# Altium schematic sheet GRITS Pi Hat.SchDoc
size C; SheetNumber: 1; SheetTotal: 1
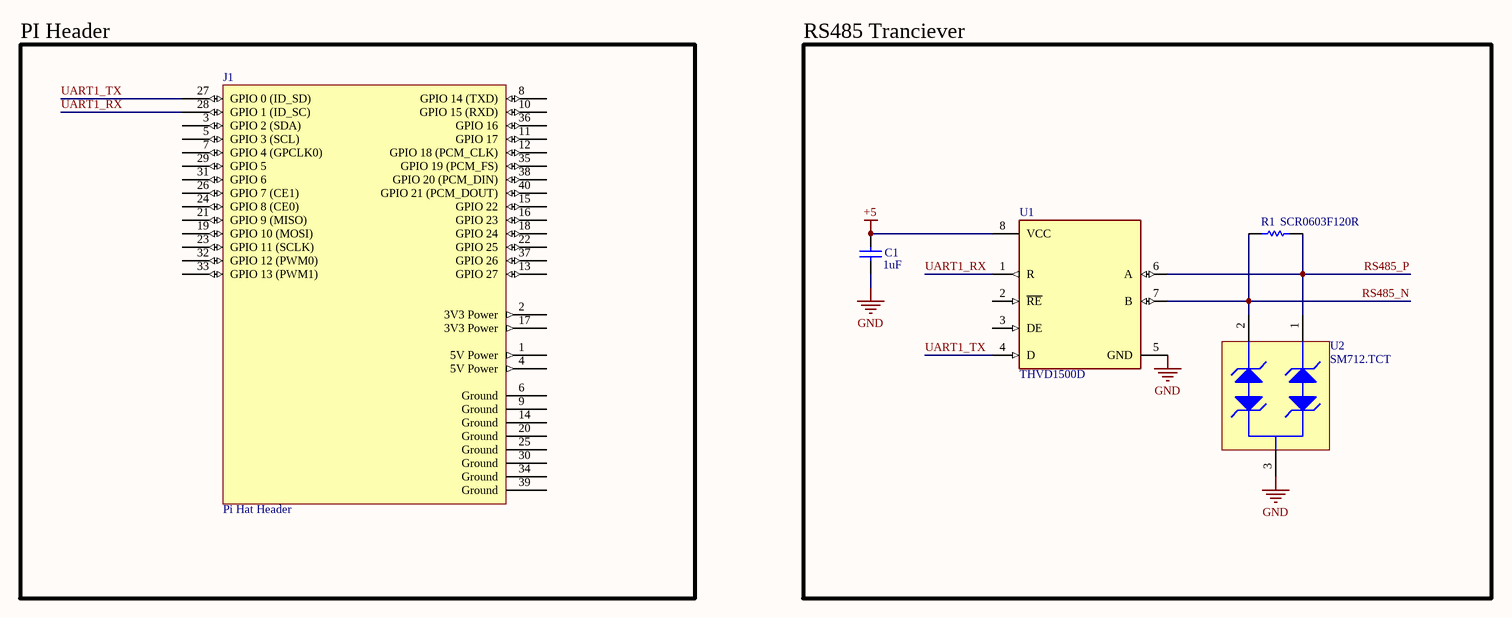
[diagram p0: GRITS Pi Hat.SchDoc]

## Parts
C1  value 1uF  [CL10A105KB8NNNC]  (hidden comment: CL10A105KB8NNNC)
J1  Pi Hat Header  [CONN_ESQ-120-33-T-D]
R1  SCR0603F120R  [SCR0603F120R]
U1  THVD1500D  [FP-D0008B-IPC_A]
U2  SM712.TCT  [SMTC-SOT23-3_V]

## Blocks framed on the sheet
PI Header: J1
RS485 Tranciever: C1 R1 U1 U2

## Nets
+5: C1.1 U1.8(VCC)
GND: C1.2 U1.5(GND) U2.3
RS485_N: R1.1 U1.7(B) U2.2
RS485_P: R1.2 U1.6(A) U2.1
UART1_RX: J1.28(GPIO_1_(ID_SC)) U1.1(R)
UART1_TX: J1.27(GPIO_0_(ID_SD)) U1.4(D)

Not connected (* = marked no-connect by the designer): J1 1(5V_Power) 2(3V3_Power) 3(GPIO_2_(SDA)) 4(5V_Power) 5(GPIO_3_(SCL)) 6(Ground) 7(GPIO_4_(GPCLK0)) 8(GPIO_14_(TXD)) 9(Ground) 10(GPIO_15_(RXD)) 11(GPIO_17) 12(GPIO_18_(PCM_CLK)) 13(GPIO_27) 14(Ground) 15(GPIO_22) 16(GPIO_23) 17(3V3_Power) 18(GPIO_24) 19(GPIO_10_(MOSI)) 20(Ground) 21(GPIO_9_(MISO)) 22(GPIO_25) 23(GPIO_11_(SCLK)) 24(GPIO_8_(CE0)) 25(Ground) 26(GPIO_7_(CE1)) 29(GPIO_5) 30(Ground) 31(GPIO_6) 32(GPIO_12_(PWM0)) 33(GPIO_13_(PWM1)) 34(Ground) 35(GPIO_19_(PCM_FS)) 36(GPIO_16) 37(GPIO_26) 38(GPIO_20_(PCM_DIN)) 39(Ground) 40(GPIO_21_(PCM_DOUT)); U1 2(~{RE}) 3(DE)

## Library data of the parts
C1 = CL10A105KB8NNNC: 50V 1uF X5R ±10% 0603 Multilayer Ceramic Capacitors MLCC - SMD/SMT ROHS
J1 = Pi Hat Header: RaspberryPi 5 Header
R1 = SCR0603F120R: 50V 1uF X5R ±10% 0603 Multilayer Ceramic Capacitors MLCC - SMD/SMT ROHS
U1 = CMP-04875-000034-1: IC TRANSCEIVER HALF 1/1 8SOIC; Output Current per Channel: 75mA; Input Offset Voltage (Vos): 200uV; Number of Circuits: 1; Operating Supply Current: 1.6mA; Data Rate: 300Kbps; Receiver Hysteresis: 50mV; Slew Rate: 10V/µs; Simplex/Duplex: Half Duplex; Gain Bandwidth Product: 10MHz; Input Bias Current: 8pA; Case/Package: VSSOP; Max Operating Temperature: 125°C; Mount: Surface Mount; Min Operating Temperature: -40°C; Packaging: Tape and Reel; RoHS Compliant: Yes
U2 = CMP-2000-05357-1: Asymmetrical TVS Diode for Extended Common-Mode RS-485, 400 W, -55 to 125 degC, 3-Pin SOT23, RoHS, Tape and Reel; Manufacturer: Semtech; Configuration: Dual; Peak Pulse Power Dissipation: 400W; Product Length (mm): 2.9mm; Working Voltage: 12V/7V; Product Height (mm): 0.95mm; Direction Type: Bi-Directional; Product Depth (mm): 1.3mm; Reverse Breakdown Voltage: 13.3V; Reverse Stand-off Voltage: 12V; Leakage Current (Max): 0.02uA; Number of Elements: 2; Peak Pulse Current: 17A; Leakage Current: 1uA/20uA; Rad Hardened: No; Test Current (It): 1mA; Clamping Voltage: 26V/12V; Datasheet URL: https://datasheet.ciiva.com/18065/getdatasheetpartid-110620-18065348.pdf; Operating Temperature Classification: Military; Operating Temperature Min Deg. C: -55C; Manufacturer URL: http://www.semtech.com/; Package Reference: SOT23-3; Operating Temp Range: -55Cto125C; Mounting Style: SurfaceMount; Polarity: Bi-Directional; Pin Count: 3; Package Description: 3-Pin Small Outline Transistor, Body 2.9 x 1.3 mm, Pitch 0.95 mm; Datasheet Version: Nov-04; Mounting: SurfaceMount; Suppressor Type: TVS; Packaging: TapeandReel; Package / Case: SOT-23; Operating Temperature Max Deg. C: 125C